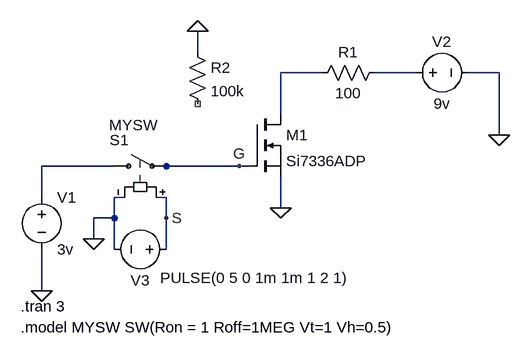
[diagram p0: schematic electronics_nmos_depletion.asc]
electronics_nmos_depletion.asc, the LTspice schematic file:
Version 4
SHEET 1 880 680
WIRE 80 16 80 -16
WIRE 272 48 208 48
WIRE 416 48 352 48
WIRE 544 48 496 48
WIRE 208 112 208 48
WIRE 544 144 544 48
WIRE -48 192 -160 192
WIRE 32 192 16 192
WIRE 144 192 32 192
WIRE 160 192 144 192
WIRE -160 240 -160 192
WIRE -32 240 -48 240
WIRE 32 240 16 240
WIRE 208 256 208 208
WIRE -48 272 -48 240
WIRE -48 272 -80 272
WIRE 32 272 32 240
WIRE -80 304 -80 272
WIRE -48 320 -48 272
WIRE 32 320 32 272
WIRE -160 384 -160 320
FLAG -160 384 0
FLAG 544 144 0
FLAG 208 256 0
FLAG 32 272 S
FLAG 80 -16 0
FLAG 144 192 G
FLAG -80 304 0
SYMBOL nmos 160 112 R0
SYMATTR InstName M1
SYMATTR Value Si7336ADP
SYMBOL sw -64 192 R270
WINDOW 0 40 9 VRight 2
WINDOW 3 63 8 VRight 2
SYMATTR InstName S1
SYMATTR Value MYSW
SYMBOL voltage -160 224 R0
WINDOW 123 0 0 Left 0
WINDOW 39 0 0 Left 0
SYMATTR InstName V1
SYMATTR Value 3v
SYMBOL res 368 32 R90
WINDOW 0 0 56 VBottom 2
WINDOW 3 32 56 VTop 2
SYMATTR InstName R1
SYMATTR Value 100
SYMBOL voltage 400 48 R270
WINDOW 0 32 56 VTop 2
WINDOW 3 -32 56 VBottom 2
WINDOW 123 0 0 Left 0
WINDOW 39 0 0 Left 0
SYMATTR InstName V2
SYMATTR Value 9v
SYMBOL voltage 48 320 R90
WINDOW 0 32 56 VTop 2
WINDOW 3 60 -120 VBottom 2
WINDOW 123 0 0 Left 0
WINDOW 39 0 0 Left 0
SYMATTR InstName V3
SYMATTR Value PULSE(0 5 0 1m 1m 1 2 1)
SYMBOL res 64 0 R0
SYMATTR InstName R2
SYMATTR Value 100k
TEXT -192 408 Left 2 !.tran 3
TEXT -192 440 Left 2 !.model MYSW SW(Ron = 1 Roff=1MEG Vt=1 Vh=0.5)

The netlist it stands for:
* electronics_nmos_depletion.asc
M1 N001 G 0 0 Si7336ADP
S1 N003 G S 0 MYSW
V1 N003 0 3v
R1 N002 N001 100
V2 N002 0 9v
V3 S 0 PULSE(0 5 0 1m 1m 1 2 1)
R2 0 NC_01 100k
.model NMOS NMOS
.model PMOS PMOS
.lib standard.mos
.tran 3
.model MYSW SW(Ron = 1 Roff=1MEG Vt=1 Vh=0.5)
.backanno
.end